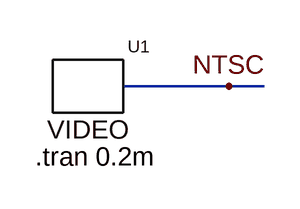
[diagram p0: schematic NTSC.asc]
NTSC.asc, the LTspice schematic file:
Version 4
SHEET 1 880 680
WIRE 240 144 144 144
WIRE 272 144 240 144
FLAG 240 144 NTSC
SYMBOL VIDEO_NTSC 112 144 R0
SYMATTR InstName U1
TEXT 64 208 Left 2 !.tran 0.2m

The netlist it stands for:
* NTSC.asc
XU1 NTSC VIDEO  ; pins 64
.tran 0.2m
.lib source.lib
.backanno
.end